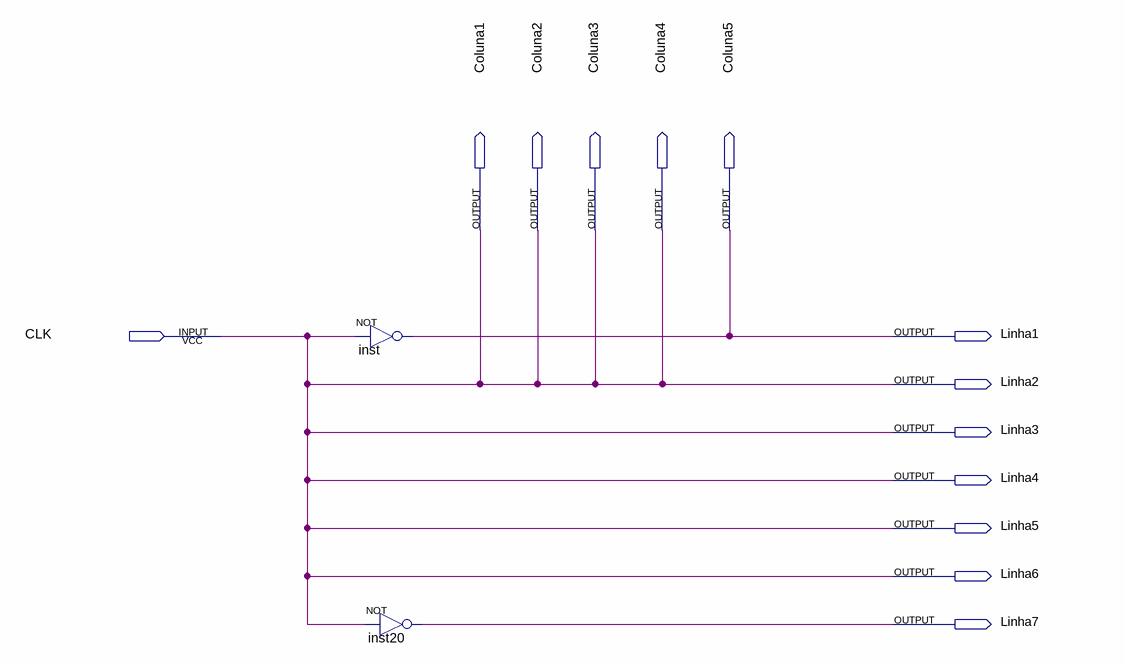
[diagram p0: schematic sheet]
// Quartus schematic LetraC.bdf as structural Verilog: 2 symbols, 13 pins
module LetraC (
  input  CLK,
  output Coluna1,
  output Coluna2,
  output Coluna3,
  output Coluna4,
  output Coluna5,
  output Linha1,
  output Linha2,
  output Linha3,
  output Linha4,
  output Linha5,
  output Linha6,
  output Linha7
);

  not inst (Coluna5, CLK);
  not inst20 (Linha7, CLK);

  assign Coluna1 = CLK;
  assign Coluna2 = CLK;
  assign Coluna3 = CLK;
  assign Coluna4 = CLK;
  assign Linha1 = Coluna5;
  assign Linha2 = CLK;
  assign Linha3 = CLK;
  assign Linha4 = CLK;
  assign Linha5 = CLK;
  assign Linha6 = CLK;
endmodule
